# EAGLE design Intar_Receiver_Module (EAGLE 7.3.0)
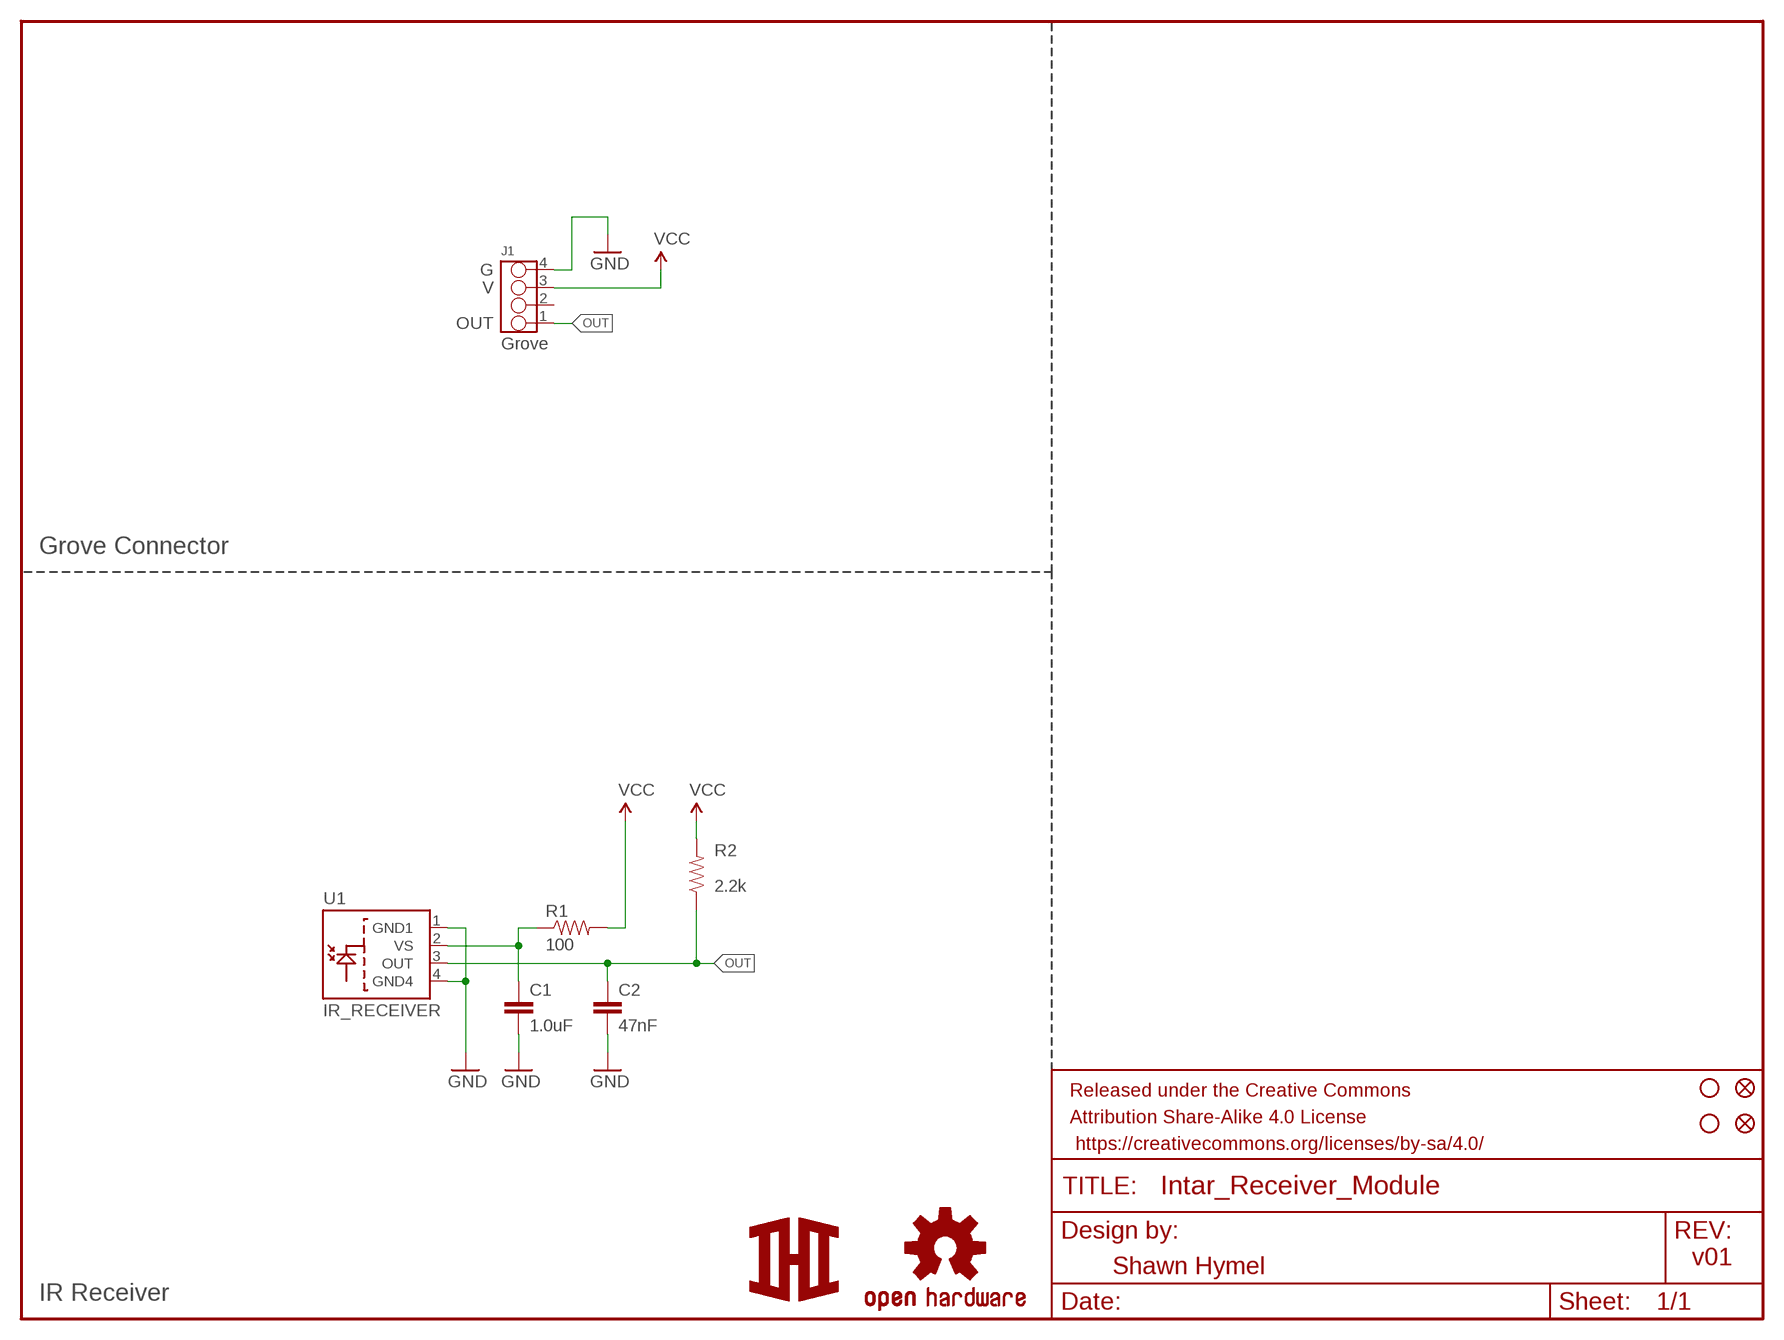
[diagram p0: schematic, sheet 1]

## Parts
C1  1.0uF  1.0UF-16V-10%(0603)  [0603-CAP]
C2  47nF  47NF(0.047UF/47000PF)-25V-5%(0603)SMD  [0603-CAP]
FID1  FIDUCIAL1X2  [FIDUCIAL-1X2]
FID2  FIDUCIAL1X2  [FIDUCIAL-1X2]
FRAME1  FRAME-LETTER  [CREATIVE_COMMONS]
J1  GROVE-4P-2.0-3470130P1  [4P-2.0]
LOGO1  OSHW-LOGOS  [OSHW-LOGO-S]
R1  100  100OHM-1/10W-1%(0603)  [0603-RES]
R2  2.2k  2.2KOHM-1/10W-1%(0603)  [0603-RES]
STANDOFF1  STAND-OFF  [STAND-OFF]
STANDOFF2  STAND-OFF  [STAND-OFF]
U1  IR_RECEIVER  [TSOP754XXW]
U$1  LOGOSM  [LOGO_SM]

## Nets
GND: C1.2 C2.2 J1.4 U1.1(GND1) U1.4(GND4)
N$2: C1.1 R1.1 U1.2(VS)
OUT: C2.1 J1.1 R2.1 U1.3(OUT)
VCC: J1.3 R1.2 R2.2
Unconnected: J1.2

## Notes on the sheet
- G
- V
- OUT
- Grove
- Grove Connector
- v01
- Shawn Hymel
- IR Receiver

## Library data of the parts
C1 = SparkFun-Capacitors:1.0UF-16V-10%(0603): CAP-00868; PROD_ID: CAP-00868
C2 = SparkFun-Capacitors:47NF(0.047UF/47000PF)-25V-5%(0603): CAP-08605; PROD_ID: CAP-08605
FID1 FID2 = SparkFun-Aesthetics:FIDUCIAL: Fiducial Alignment Points Various fiducial points for machine vision alignment.
FRAME1 = SparkFun-Aesthetics:FRAME-LETTER: Schematic Frame Standard 8.5x11 US Letter frame
J1 = Connector:GROVE-4P-2.0
LOGO1 = SparkFun-Aesthetics:OSHW-LOGO: Open Source Hardware Logo This logo indicates the piece of hardware it is found on incorporates a OSHW license and/or adheres to the definition of open source hardware found here: http://freedomdefined.org/OSHW
R1 = SparkFun-Resistors:100OHM-1/10W-1%(0603): RES-07863; PROD_ID: RES-07863
R2 = SparkFun-Resistors:2.2KOHM-1/10W-1%(0603): RES-08272; PROD_ID: RES-08272
STANDOFF1 STANDOFF2 = SparkFun-Electromechanical:STAND-OFF: #4 Stand Off This is the mechanical footprint for a #4 phillips button head screw. Use the keepout ring to avoid running the screw head into surrounding components. SKU : PRT-00447
U1 = Intar_Eagle_Library:IR_RECEIVER
U$1 = Intar_Eagle_Library:LOGO

## Board
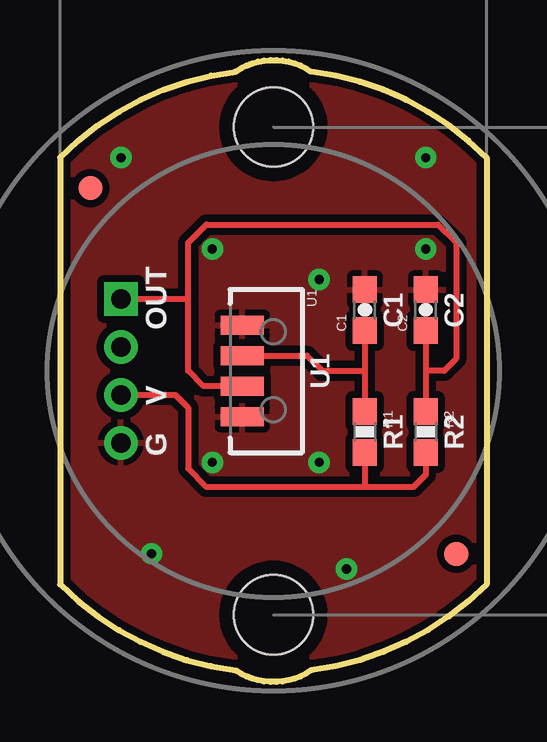
[diagram p1: board, top side]
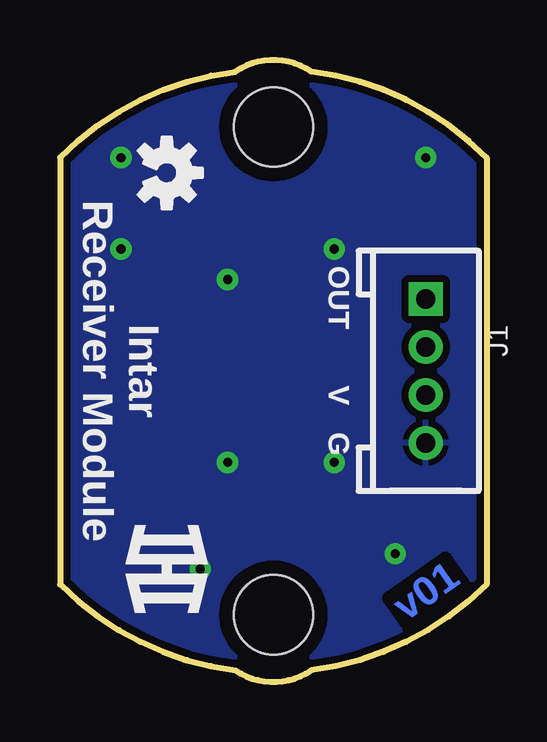
[diagram p2: board, bottom side, seen from below]

Size 17.78 x 25.91 mm. Coordinates in mm from the lower left corner, seen from the top.
Outline: 17.78,21.85 17.78,4.07 arc-38 10.46,0.48 arc-69 7.32,0.48 arc-38 0,4.07 0,21.85 arc-38 7.32,25.43 arc-69 10.46,25.43 arc-38 17.78,21.85
Copper layers (1*16): Top 0.035mm / dielectric 1.5mm / Bottom 0.035mm
Design rules "SparkFun-2-layer": minimum track width 7mil, minimum drill 15mil, track to track 8mil, track to pad 8mil, pad to pad 8mil, via to via 8mil, smd to smd 8mil, copper to edge 8mil, drill to drill 8mil, minimum pad ring 12mil, minimum via ring 10mil, stop-mask expansion 4mil, vias tented up to drill 20mil, thermal gap 10mil

### Footprints (pad centres in the part's own frame; a part is rotated, then mirrored left to right if it is on the bottom)
0603-CAP = smd 1.1 x 1: 1 -0.85,0; 2 0.85,0
FIDUCIAL-1X2 = smd 1 x 1: 1 0,0
4P-2.0 = drill 0.8 pad 1.27 square: 1 -3,0 | drill 0.8 pad 1.27: 2 -1,0; 3 1,0; 4 3,0
0603-RES = smd 1.1 x 1: 1 -0.85,0; 2 0.85,0
STAND-OFF = hole 3.302: 0,0
TSOP754XXW = smd 0.8 x 1.8: 1 -1.905,-1.3; 2 -0.635,-1.3; 3 0.635,-1.3; 4 1.905,-1.3

### Placement (x,y rotation side)
C1  12.7,15.5 90 top
C2  15.24,15.5 90 top
FID1  1.27,20.58 0 top
FID2  16.51,5.34 0 top
FRAME1  -24.13,-9.9 0 top  (outside the outline)
J1  2.54,12.96 270 bottom
LOGO1  13.34,21.21 270 bottom
R1  12.7,10.42 270 top
R2  15.24,10.42 270 top
STANDOFF1  8.89,2.8 0 top
STANDOFF2  8.89,23.12 0 top
U1  8.89,12.96 270 top
U$1  13.34,4.7 270 bottom

### Tracks (layer width: path | path; a pad name or v marks a point on that pad's centre or on a via)
GND  (via drill 0.38)
  other vias: 15.24,21.85 10.79,9.15 3.81,5.34 2.54,21.85 11.94,4.7 10.79,16.77 15.24,18.04 6.35,18.04 6.35,9.15
  pour Top (isolate 0.305): 0,26.93 0,-1.01 17.78,-1.01 17.78,26.93
  pour Bottom (isolate 0.305): 0,26.93 17.78,26.93 17.78,-1.01 0,-1.01
N$2
  Top 0.254: C1.1 12.7,12.96 | 12.7,12.96 R1.1 | U1.2 10.29,13.59 10.92,12.96 12.7,12.96
OUT
  Top 0.254: U1.3 5.97,12.32 5.33,12.96 5.33,16 | 5.33,16 5.33,18.29 6.1,19.05 15.75,19.05 16.51,18.29 16.51,13.46 16,12.96 15.24,12.96 | C2.1 15.24,12.96 | 15.24,12.96 R2.1 | J1.1 5.29,15.96 5.33,16
VCC
  Top 0.254: J1.3 4.81,11.96 5.33,11.43 5.33,8.89 6.1,8.13 12.7,8.13 | 12.7,8.13 14.73,8.13 15.24,8.64 R2.2 | R1.2 12.7,8.13

### Text on the board
Bottom: v01
tPlace: OUT | C1 | C2 | U1 | V | G | R1 | R2
bPlace: OUT | Intar / Receiver Module | V | G
tDocu: Shawn Hymel